# Altium schematic sheet STM32_CPU.SchDoc
size A3
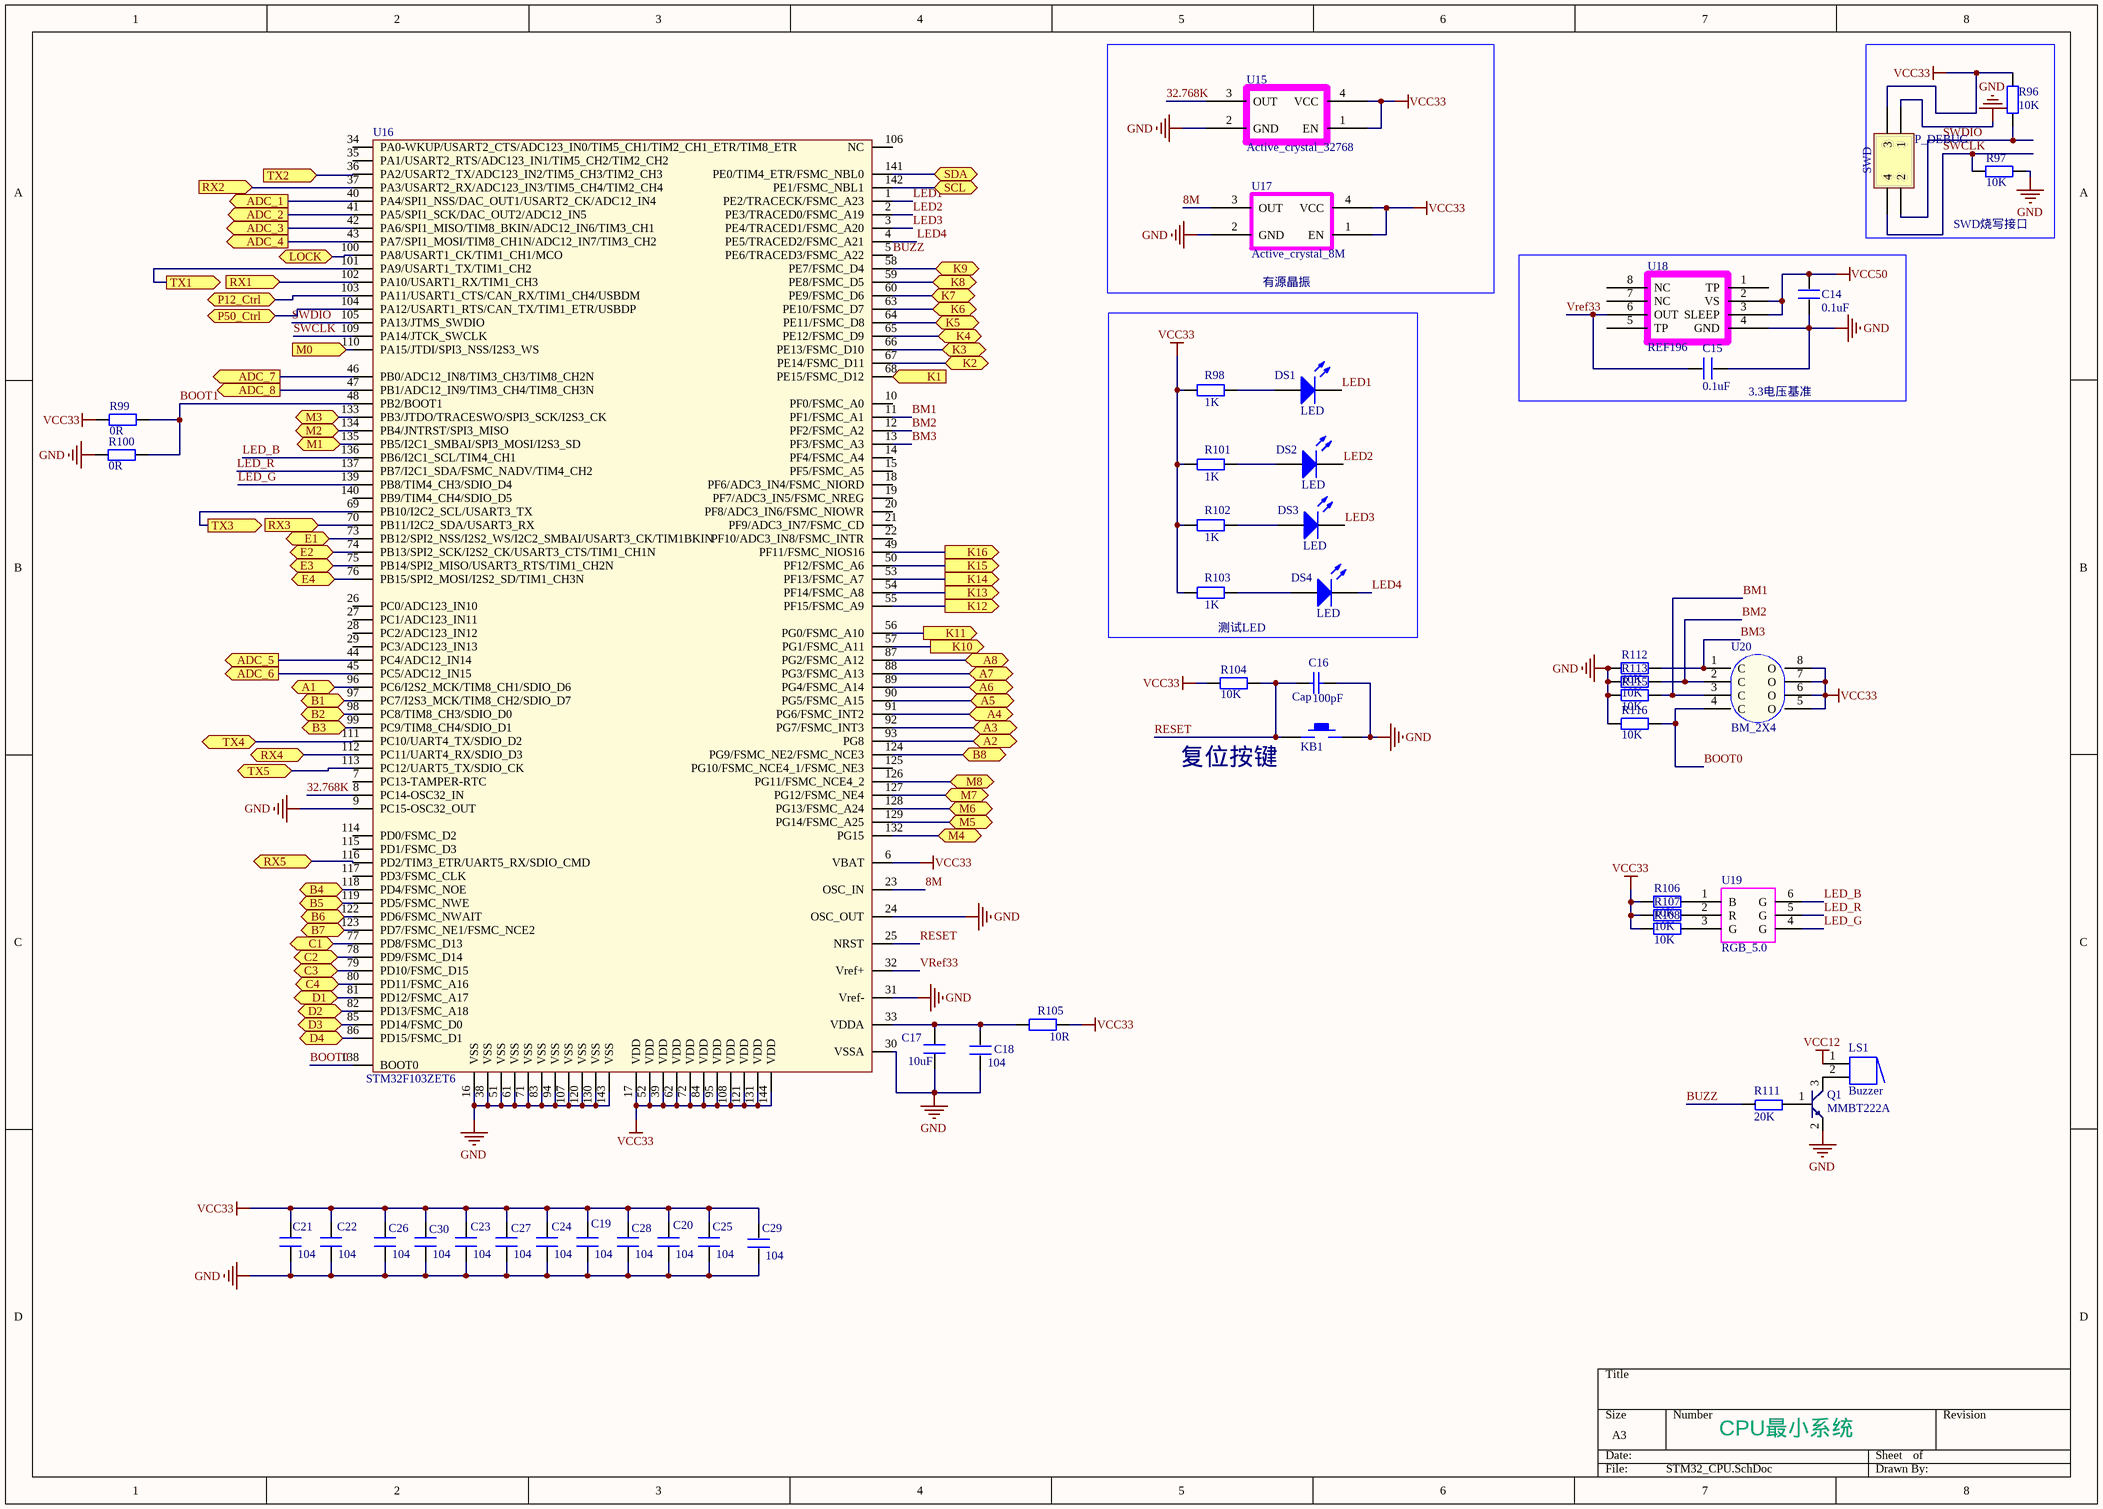
[diagram p0: STM32_CPU.SchDoc]

## Parts
C14  0.1uF  [CAPC1608L]
C15  0.1uF  [CAPC1608L]
C16  Cap  value 100pF  [1206C]
C17  10uF  [1206]
C18  104  [1206]
C19  104  [1206]
C20  104  [1206]
C21  104  [1206]
C22  104  [1206]
C23  104  [1206]
C24  104  [1206]
C25  104  [1206]
C26  104  [1206]
C27  104  [1206]
C28  104  [1206]
C29  104  [1206]
C30  104  [1206]
DS1  LED  [LED-1206]
DS2  LED  [LED-1206]
DS3  LED  [LED-1206]
DS4  LED  [LED-1206]
KB1  KEY_M  [HDR1X2]  (value not drawn)
LS1  Buzzer  [BELL]
P_DEBUG  SWD  [HDR2X2]
Q1  MMBT222A  [SOT-23]
R96  value 10K  [1206]  (hidden comment: Res2)
R97  value 10K  [1206]  (hidden comment: Res2)
R98  value 1K  [1206R]  (hidden comment: Res2)
R99  value 0R  [1206R]  (hidden comment: Res2)
R100  value 0R  [1206R]  (hidden comment: Res2)
R101  value 1K  [1206R]  (hidden comment: Res2)
R102  value 1K  [1206R]  (hidden comment: Res2)
R103  value 1K  [1206R]  (hidden comment: Res2)
R104  value 10K  [1206R]  (hidden comment: Res2)
R105  value 10R  [1206]  (hidden comment: Res2)
R106  value 10K  [1206]  (hidden comment: Res2)
R107  value 10K  [1206]  (hidden comment: Res2)
R108  value 10K  [1206]  (hidden comment: Res2)
R111  20K  [1206R]
R112  value 10K  [1206]  (hidden comment: Res2)
R113  value 10K  [1206]  (hidden comment: Res2)
R115  value 10K  [1206]  (hidden comment: Res2)
R116  value 10K  [1206]  (hidden comment: Res2)
U15  Active_crystal_32768  [Active_crystal_3225]
U16  STM32F103ZET6  [LQFP144]
U17  Active_crystal_8M  [Active_crystal_3225]
U18  REF196  [SOP8N]
U19  RGB_5.0  [RGB_5.0]
U20  BM_2X4  [BM_2X4]

## Blocks framed on the sheet
有源晶振: U15 U17
SWD烧写接口: P_DEBUG R96 R97
3.3电压基准: C14 C15 U18
测试LED: DS1-DS4 R98 R101-R103

## Ports
A1, A2, A3, A4, A5, A6, A7, A8, ADC_1 (out), ADC_2 (out), ADC_3 (out), ADC_4 (out), ADC_5 (out), ADC_6 (out), ADC_7 (out), ADC_8 (out), B1, B2, B3, B4, B5, B6, B7, B8, C1, C2, C3, C4, D1, D2, D3, D4, E1, E2, E3, E4, K1 (out), K2, K3, K4, K5, K6, K7, K8, K9, K10 (out), K11 (out), K12 (out), K13 (out), K14 (out), K15 (out), K16 (out), LOCK, M0 (in), M1, M2, M3, M4, M5, M6, M7, M8, P12_Ctrl, P50_Ctrl, RX1 (in), RX2, RX3 (in), RX4 (bidir), RX5, SCL (bidir), SDA (bidir), TX1 (out), TX2, TX3 (out), TX4 (bidir), TX5

## Nets
GND: C14.1 C15.2 C16.1 C17.2 C18.2 C19.2 C20.2 C21.2 C22.2 C23.2 C24.2 C25.2 C26.2 C27.2 C28.2 C29.2 C30.2 KB1.2 P_DEBUG.1 Q1.2(E) R97.2 R100.2 R112.1 R113.1 R115.1 R116.1 U15.2(GND) U16.9(PC15-OSC32_OUT) U16.16(VSS) U16.24(OSC_OUT) U16.30(VSSA) U16.31(Vref-) U16.38(VSS) U16.51(VSS) U16.61(VSS) U16.71(VSS) U16.83(VSS) U16.94(VSS) U16.107(VSS) U16.120(VSS) U16.130(VSS) U16.143(VSS) U17.2(GND) U18.4(GND)
VCC12: LS1.1
VCC33: C19.1 C20.1 C21.1 C22.1 C23.1 C24.1 C25.1 C26.1 C27.1 C28.1 C29.1 C30.1 P_DEBUG.3 R96.2 R98.1 R99.2 R101.1 R102.1 R103.1 R104.2 R105.1 R106.2 R107.2 R108.2 U15.1(EN) U15.4(VCC) U16.6(VBAT) U16.17(VDD) U16.39(VDD) U16.52(VDD) U16.62(VDD) U16.72(VDD) U16.84(VDD) U16.95(VDD) U16.108(VDD) U16.121(VDD) U16.131(VDD) U16.144(VDD) U17.1(EN) U17.4(VCC) U20.5(O) U20.6(O) U20.7(O) U20.8(O)
VCC50: C14.2 U18.2(VS) U18.3(SLEEP)
8M: U16.23(OSC_IN) U17.3(OUT)
32.768K: U15.3(OUT) U16.8(PC14-OSC32_IN)
A1: U16.96(PC6/I2S2_MCK/TIM8_CH1/SDIO_D6) ; port A1
A2: U16.93(PG8) ; port A2
A3: U16.92(PG7/FSMC_INT3) ; port A3
A4: U16.91(PG6/FSMC_INT2) ; port A4
A5: U16.90(PG5/FSMC_A15) ; port A5
A6: U16.89(PG4/FSMC_A14) ; port A6
A7: U16.88(PG3/FSMC_A13) ; port A7
A8: U16.87(PG2/FSMC_A12) ; port A8
ADC_1: U16.40(PA4/SPI1_NSS/DAC_OUT1/USART2_CK/ADC12_IN4) ; port ADC_1
ADC_2: U16.41(PA5/SPI1_SCK/DAC_OUT2/ADC12_IN5) ; port ADC_2
ADC_3: U16.42(PA6/SPI1_MISO/TIM8_BKIN/ADC12_IN6/TIM3_CH1) ; port ADC_3
ADC_4: U16.43(PA7/SPI1_MOSI/TIM8_CH1N/ADC12_IN7/TIM3_CH2) ; port ADC_4
ADC_5: U16.44(PC4/ADC12_IN14) ; port ADC_5
ADC_6: U16.45(PC5/ADC12_IN15) ; port ADC_6
ADC_7: U16.46(PB0/ADC12_IN8/TIM3_CH3/TIM8_CH2N) ; port ADC_7
ADC_8: U16.47(PB1/ADC12_IN9/TIM3_CH4/TIM8_CH3N) ; port ADC_8
B1: U16.97(PC7/I2S3_MCK/TIM8_CH2/SDIO_D7) ; port B1
B2: U16.98(PC8/TIM8_CH3/SDIO_D0) ; port B2
B3: U16.99(PC9/TIM8_CH4/SDIO_D1) ; port B3
B4: U16.118(PD4/FSMC_NOE) ; port B4
B5: U16.119(PD5/FSMC_NWE) ; port B5
B6: U16.122(PD6/FSMC_NWAIT) ; port B6
B7: U16.123(PD7/FSMC_NE1/FSMC_NCE2) ; port B7
B8: U16.124(PG9/FSMC_NE2/FSMC_NCE3) ; port B8
BM1: R115.2 U16.11(PF1/FSMC_A1) U20.3(C)
BM2: R113.2 U16.12(PF2/FSMC_A2) U20.2(C)
BM3: R112.2 U16.13(PF3/FSMC_A3) U20.1(C)
BOOT0: R116.2 U16.138(BOOT0) U20.4(C)
BOOT1: R99.1 R100.1 U16.48(PB2/BOOT1)
BUZZ: R111.1 U16.5(PE6/TRACED3/FSMC_A22)
C1: U16.77(PD8/FSMC_D13) ; port C1
C2: U16.78(PD9/FSMC_D14) ; port C2
C3: U16.79(PD10/FSMC_D15) ; port C3
C4: U16.80(PD11/FSMC_A16) ; port C4
D1: U16.81(PD12/FSMC_A17) ; port D1
D2: U16.82(PD13/FSMC_A18) ; port D2
D3: U16.85(PD14/FSMC_D0) ; port D3
D4: U16.86(PD15/FSMC_D1) ; port D4
E1: U16.73(PB12/SPI2_NSS/I2S2_WS/I2C2_SMBAI/USART3_CK/TIM1BKIN) ; port E1
E2: U16.74(PB13/SPI2_SCK/I2S2_CK/USART3_CTS/TIM1_CH1N) ; port E2
E3: U16.75(PB14/SPI2_MISO/USART3_RTS/TIM1_CH2N) ; port E3
E4: U16.76(PB15/SPI2_MOSI/I2S2_SD/TIM1_CH3N) ; port E4
K1: U16.68(PE15/FSMC_D12) ; port K1
K2: U16.67(PE14/FSMC_D11) ; port K2
K3: U16.66(PE13/FSMC_D10) ; port K3
K4: U16.65(PE12/FSMC_D9) ; port K4
K5: U16.64(PE11/FSMC_D8) ; port K5
K6: U16.63(PE10/FSMC_D7) ; port K6
K7: U16.60(PE9/FSMC_D6) ; port K7
K8: U16.59(PE8/FSMC_D5) ; port K8
K9: U16.58(PE7/FSMC_D4) ; port K9
K10: U16.57(PG1/FSMC_A11) ; port K10
K11: U16.56(PG0/FSMC_A10) ; port K11
K12: U16.55(PF15/FSMC_A9) ; port K12
K13: U16.54(PF14/FSMC_A8) ; port K13
K14: U16.53(PF13/FSMC_A7) ; port K14
K15: U16.50(PF12/FSMC_A6) ; port K15
K16: U16.49(PF11/FSMC_NIOS16) ; port K16
LED1: DS1.2(K) U16.1(PE2/TRACECK/FSMC_A23)
LED2: DS2.2(K) U16.2(PE3/TRACED0/FSMC_A19)
LED3: DS3.2(K) U16.3(PE4/TRACED1/FSMC_A20)
LED4: DS4.2(K) U16.4(PE5/TRACED2/FSMC_A21)
LED_B: U16.136(PB6/I2C1_SCL/TIM4_CH1) U19.6(G)
LED_G: U16.139(PB8/TIM4_CH3/SDIO_D4) U19.4(G)
LED_R: U16.137(PB7/I2C1_SDA/FSMC_NADV/TIM4_CH2) U19.5(G)
LOCK: U16.100(PA8/USART1_CK/TIM1_CH1/MCO) ; port LOCK
M0: U16.110(PA15/JTDI/SPI3_NSS/I2S3_WS) ; port M0
M1: U16.135(PB5/I2C1_SMBAI/SPI3_MOSI/I2S3_SD) ; port M1
M2: U16.134(PB4/JNTRST/SPI3_MISO) ; port M2
M3: U16.133(PB3/JTDO/TRACESWO/SPI3_SCK/I2S3_CK) ; port M3
M4: U16.132(PG15) ; port M4
M5: U16.129(PG14/FSMC_A25) ; port M5
M6: U16.128(PG13/FSMC_A24) ; port M6
M7: U16.127(PG12/FSMC_NE4) ; port M7
M8: U16.126(PG11/FSMC_NCE4_2) ; port M8
P12_Ctrl: U16.103(PA11/USART1_CTS/CAN_RX/TIM1_CH4/USBDM) ; port P12_Ctrl
P50_Ctrl: U16.104(PA12/USART1_RTS/CAN_TX/TIM1_ETR/USBDP) ; port P50_Ctrl
RESET: C16.2 KB1.1 R104.1 U16.25(NRST)
RX1: U16.102(PA10/USART1_RX/TIM1_CH3) ; port RX1
RX2: U16.37(PA3/USART2_RX/ADC123_IN3/TIM5_CH4/TIM2_CH4) ; port RX2
RX3: U16.70(PB11/I2C2_SDA/USART3_RX) ; port RX3
RX4: U16.112(PC11/UART4_RX/SDIO_D3) ; port RX4
RX5: U16.116(PD2/TIM3_ETR/UART5_RX/SDIO_CMD) ; port RX5
SCL: U16.142(PE1/FSMC_NBL1) ; port SCL
SDA: U16.141(PE0/TIM4_ETR/FSMC_NBL0) ; port SDA
SWCLK: P_DEBUG.4 R97.1 U16.109(PA14/JTCK_SWCLK)
SWDIO: P_DEBUG.2 R96.1 U16.105(PA13/JTMS_SWDIO)
TX1: U16.101(PA9/USART1_TX/TIM1_CH2) ; port TX1
TX2: U16.36(PA2/USART2_TX/ADC123_IN2/TIM5_CH3/TIM2_CH3) ; port TX2
TX3: U16.69(PB10/I2C2_SCL/USART3_TX) ; port TX3
TX4: U16.111(PC10/UART4_TX/SDIO_D2) ; port TX4
TX5: U16.113(PC12/UART5_TX/SDIO_CK) ; port TX5
Vref33: C15.1 U16.32(Vref+) U18.6(OUT)
NetC17_1: C17.1 C18.1 R105.2 U16.33(VDDA)
NetDS1_1: DS1.1(A) R98.2
NetDS2_1: DS2.1(A) R101.2
NetDS3_1: DS3.1(A) R102.2
NetDS4_1: DS4.1(A) R103.2
NetLS1_2: LS1.2 Q1.3(C)
NetQ1_1: Q1.1(B) R111.2
NetR106_1: R106.1 U19.1(B)
NetR107_1: R107.1 U19.2(R)
NetR108_1: R108.1 U19.3(G)

Not connected (* = marked no-connect by the designer): U16 7(PC13-TAMPER-RTC) 10(PF0/FSMC_A0) 14(PF4/FSMC_A4) 15(PF5/FSMC_A5) 18(PF6/ADC3_IN4/FSMC_NIORD) 19(PF7/ADC3_IN5/FSMC_NREG) 20(PF8/ADC3_IN6/FSMC_NIOWR) 21(PF9/ADC3_IN7/FSMC_CD) 22(PF10/ADC3_IN8/FSMC_INTR) 26(PC0/ADC123_IN10) 27(PC1/ADC123_IN11) 28(PC2/ADC123_IN12) 29(PC3/ADC123_IN13) 34(PA0-WKUP/USART2_CTS/ADC123_IN0/TIM5_CH1/TIM2_CH1_ETR/TIM8_ETR) 35(PA1/USART2_RTS/ADC123_IN1/TIM5_CH2/TIM2_CH2) 106(NC) 114(PD0/FSMC_D2) 115(PD1/FSMC_D3) 117(PD3/FSMC_CLK) 125(PG10/FSMC_NCE4_1/FSMC_NE3) 140(PB9/TIM4_CH4/SDIO_D5); U18 1(TP) 5(TP) 7(NC) 8(NC)

## Notes on the sheet
- 复位按键
- CPU最小系统

## Library data of the parts
C14 C15 C17-C30 = C
C16 = Cap: Capacitor; Published: 8-Jun-2000; LatestRevisionDate: 17-Jul-2002; LatestRevisionNote: Re-released for DXP Platform.; PackageReference: RAD-0.3; Publisher: Altium Limited
DS1-DS4 = LED2: Typical RED, GREEN, YELLOW, AMBER GaAs LED; Published: 8-Jun-2000; LatestRevisionDate: 17-Jul-2002; LatestRevisionNote: Re-released for DXP Platform.; PackageDocument: Feb-2002; PackageReference: 3.2X1.6X1.1; Publisher: Altium Limited
LS1 = Buzzer: Magnetic Transducer Buzzer; Published: 24-Mar-1999; LatestRevisionDate: 17-Dec-2003; LatestRevisionNote: Schematic revised, PCB Footprint replaced.; DatasheetVersion: 17-Dec-2003; PackageReference: ABSM-1574; Publisher: Altium Limited; ComponentLink1Description: Manufacturer Link; ComponentLink1URL: http://www.megastar.com/linecard/buzzmode/index.php
P_DEBUG = Header 2X2: Header, 2-Pin, Dual row; LatestRevisionDate: 17-Jul-2002; LatestRevisionNote: Re-released for DXP Platform.; Publisher: Altium Limited
Q1 = NPN: 8050/BCW846/BCW847
R96-R108 R112 R113 R115 R116 = Res2: Resistor; Published: 8-Jun-2000; LatestRevisionDate: 17-Jul-2002; LatestRevisionNote: Re-released for DXP Platform.; PackageReference: AXIAL-0.4; Publisher: Altium Limited
R111 = R